# Altium schematic sheet BBB_Connections.SchDoc
size Tabloid
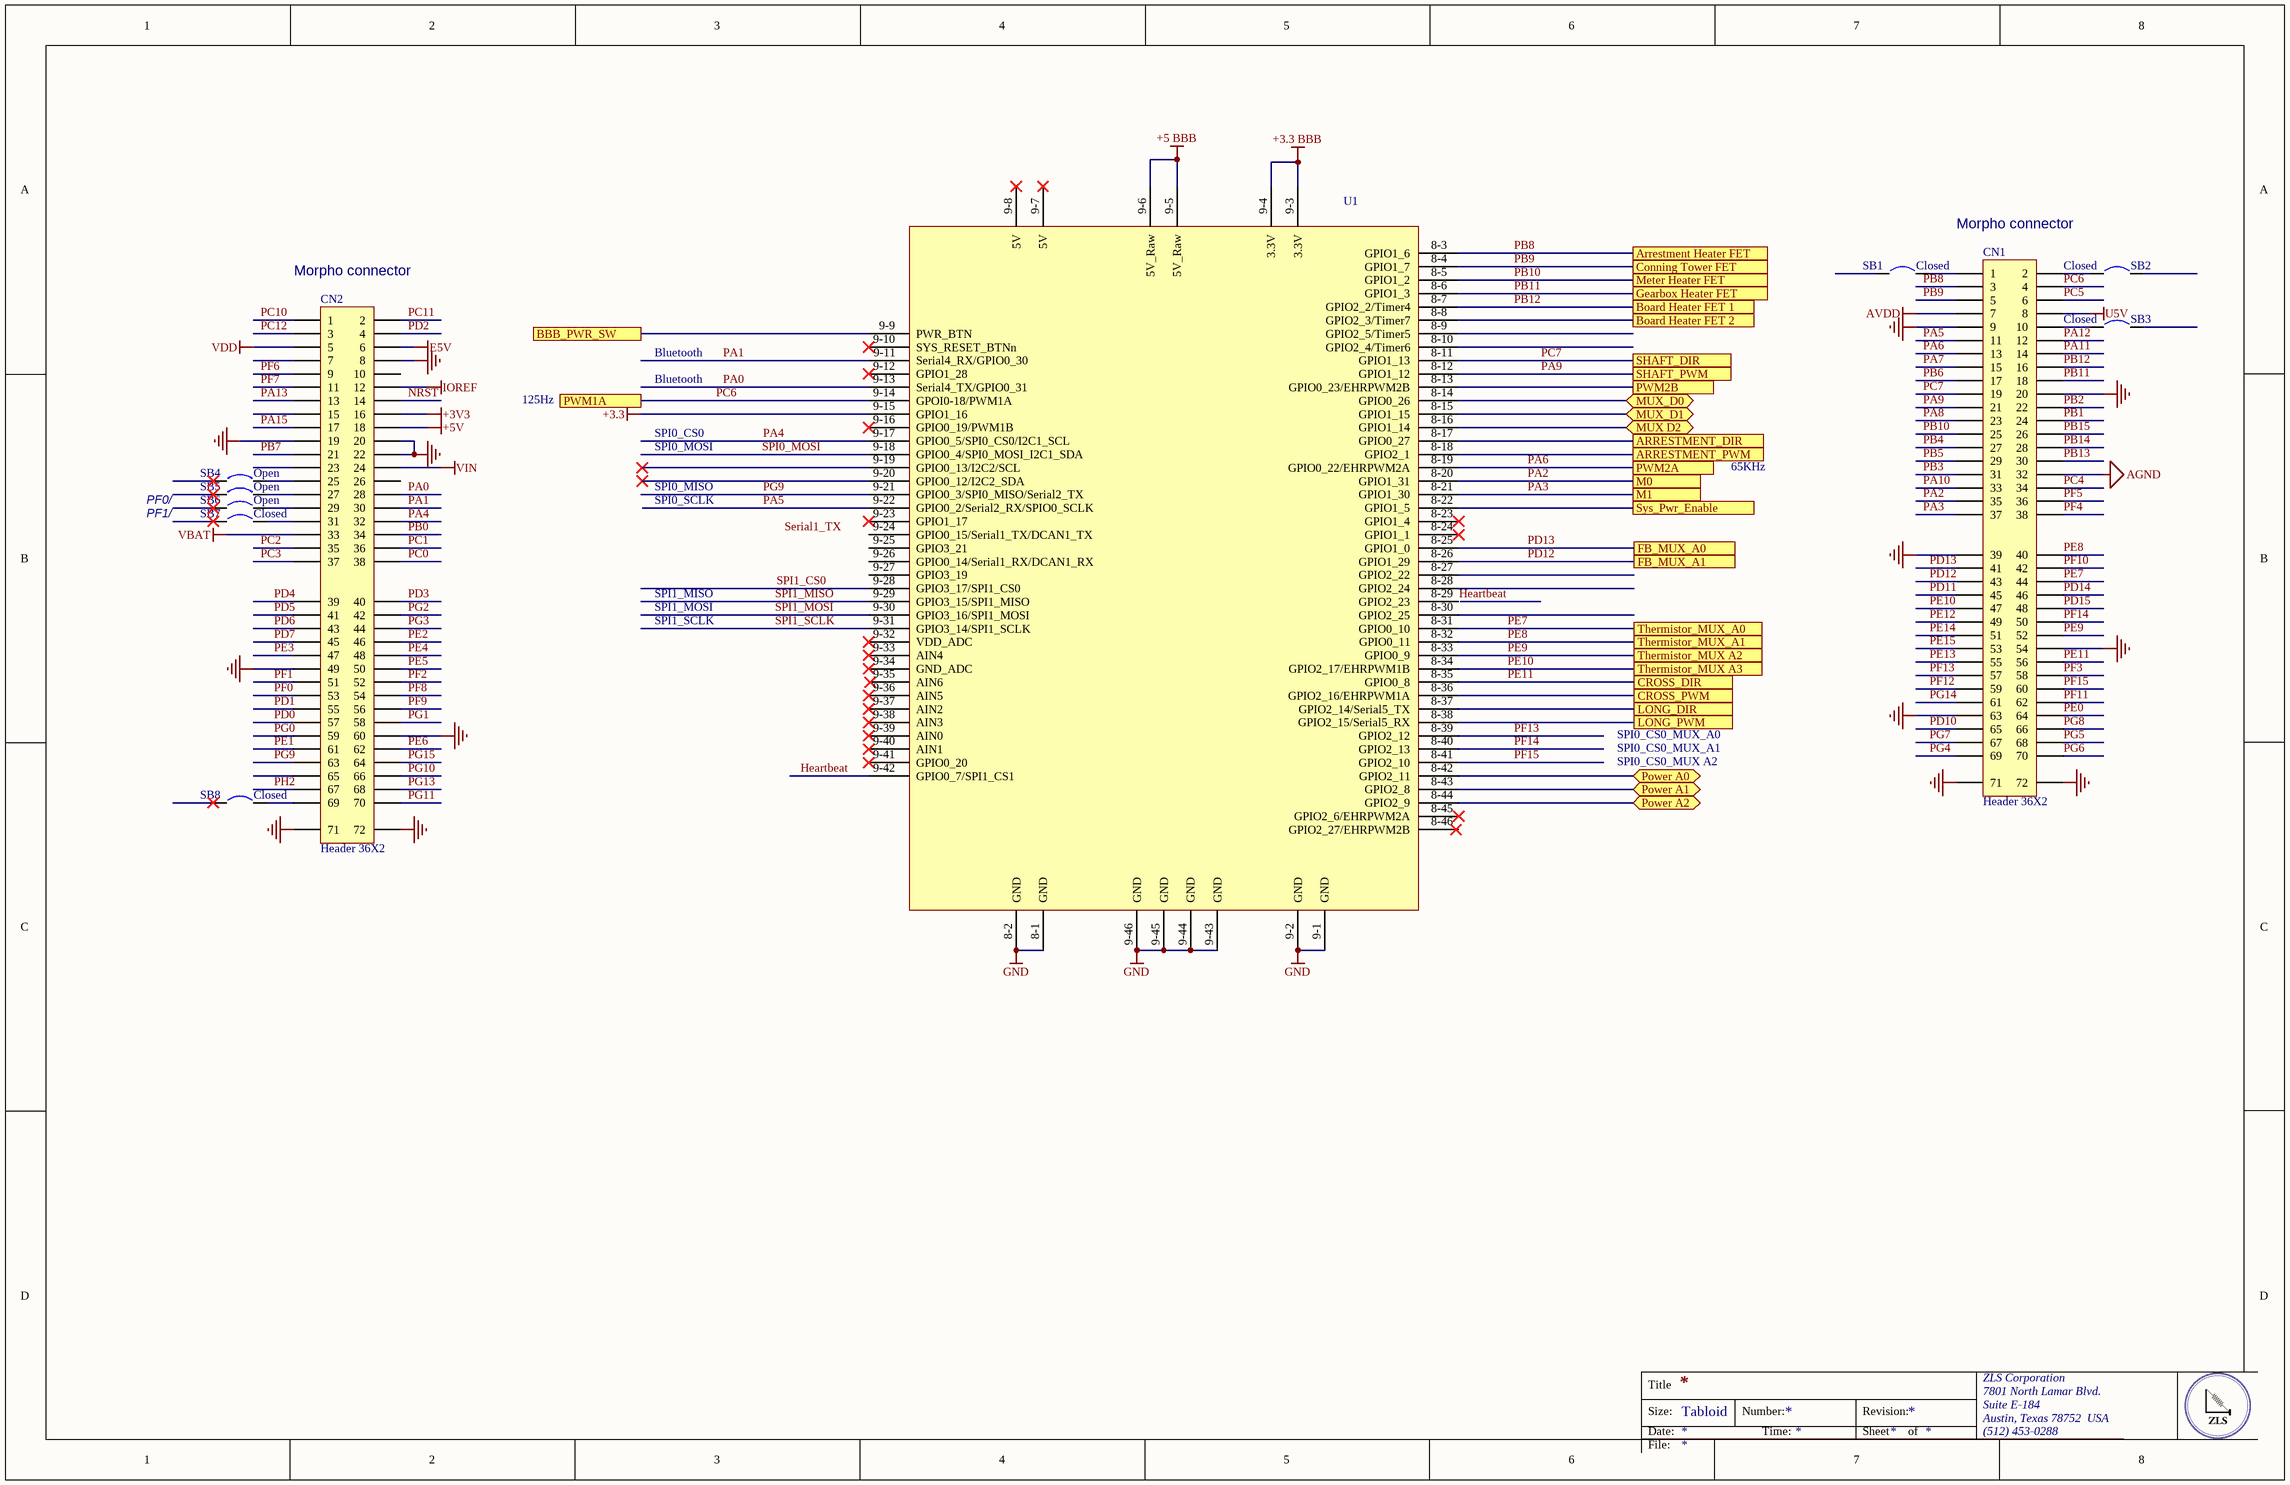
[diagram p0: BBB_Connections.SchDoc]

## Parts
CN1  Header 36X2  [HDR_2x36_2R54_V_M]
CN2  Header 36X2  [HDR_2x36_2R54_V_M]
SB1  Closed  [SB_0603]
SB2  Closed  [SB_0603]
SB3  Closed  [SB_0603]
SB4  Open  [SB_0603]
SB5  Open  [SB_0603]
SB6  Open  [SB_0603]
SB7  Closed  [SB_0603]
SB8  Closed  [SB_0603]
U1  BBB Header x 2  [Beaglebone Black Thru]  (value not drawn)

## Ports
Arrestment Heater FET, ARRESTMENT_DIR, ARRESTMENT_PWM, BBB_PWR_SW, Board Heater FET 1, Board Heater FET 2, Conning Tower FET, CROSS_DIR, CROSS_PWM, FB_MUX_A0, FB_MUX_A1, Gearbox Heater FET, LONG_DIR, LONG_PWM, M0, M1, Meter Heater FET, MUX D2, MUX_D0, MUX_D1, Power A0, Power A1, Power A2, PWM1A, PWM2A, PWM2B, SHAFT_DIR, SHAFT_PWM, Sys_Pwr_Enable, Thermistor_MUX A2, Thermistor_MUX A3, Thermistor_MUX_A0, Thermistor_MUX_A1

## Nets
+3.3: U1.9-15(GPIO1_16)
+3.3 BBB: U1.9-3(3.3V) U1.9-4(3.3V)
+3V3: CN2.16
+5 BBB: U1.9-5(5V_Raw) U1.9-6(5V_Raw)
+5V: CN2.18
AGND: CN1.32
AVDD: CN1.7
E5V: CN2.6
GND: CN1.9 CN1.20 CN1.39 CN1.54 CN1.63 CN1.71 CN1.72 CN2.8 CN2.19 CN2.20 CN2.22 CN2.49 CN2.60 CN2.71 CN2.72 U1.8-1(GND) U1.8-2(GND) U1.9-1(GND) U1.9-2(GND) U1.9-43(GND) U1.9-44(GND) U1.9-45(GND) U1.9-46(GND)
IOREF: CN2.12
U5V: CN1.8
VBAT: CN2.33
VDD: CN2.5
VIN: CN2.24
ARRESTMENT_DIR: U1.8-17(GPIO0_27) ; port ARRESTMENT_DIR
ARRESTMENT_PWM: U1.8-18(GPIO2_1) ; port ARRESTMENT_PWM
BBB_PWR_SW: U1.9-9(PWR_BTN) ; port BBB_PWR_SW
Board Heater FET 2: U1.8-8(GPIO2_3/Timer7) ; port Board Heater FET 2
CROSS_PWM: U1.8-36(GPIO2_16/EHRPWM1A) ; port CROSS_PWM
Heartbeat: U1.8-29(GPIO2_23) U1.9-42(GPIO0_7/SPI1_CS1)
LONG_DIR: U1.8-37(GPIO2_14/Serial5_TX) ; port LONG_DIR
LONG_PWM: U1.8-38(GPIO2_15/Serial5_RX) ; port LONG_PWM
MUX D2: U1.8-16(GPIO1_14) ; port MUX D2
MUX_D0: U1.8-14(GPIO0_26) ; port MUX_D0
MUX_D1: U1.8-15(GPIO1_15) ; port MUX_D1
NRST: CN2.14
PA0: CN2.28 U1.9-13(Serial4_TX/GPIO0_31)
PA1: CN2.30 U1.9-11(Serial4_RX/GPIO0_30)
PA2: CN1.35 U1.8-20(GPIO1_31) ; port M0
PA3: CN1.37 U1.8-21(GPIO1_30) ; port M1
PA4: CN2.32 U1.9-17(GPIO0_5/SPI0_CS0/I2C1_SCL)
PA5: CN1.11 U1.9-22(GPIO0_2/Serial2_RX/SPIO0_SCLK)
PA6: CN1.13 U1.8-19(GPIO0_22/EHRPWM2A) ; port PWM2A
PA7: CN1.15
PA8: CN1.23
PA9: CN1.21 U1.8-12(GPIO1_12) ; port SHAFT_PWM
PA10: CN1.33
PA11: CN1.14
PA12: CN1.12
PA13: CN2.13
PA15: CN2.17
PB0: CN2.34
PB1: CN1.24
PB2: CN1.22
PB3: CN1.31
PB4: CN1.27
PB5: CN1.29
PB6: CN1.17
PB7: CN2.21
PB8: CN1.3 U1.8-3(GPIO1_6) ; port Arrestment Heater FET
PB9: CN1.5 U1.8-4(GPIO1_7) ; port Conning Tower FET
PB10: CN1.25 U1.8-5(GPIO1_2) ; port Meter Heater FET
PB11: CN1.18 U1.8-6(GPIO1_3) ; port Gearbox Heater FET
PB12: CN1.16 U1.8-7(GPIO2_2/Timer4) ; port Board Heater FET 1
PB13: CN1.30
PB14: CN1.28
PB15: CN1.26
PC0: CN2.38
PC1: CN2.36
PC2: CN2.35
PC3: CN2.37
PC4: CN1.34
PC5: CN1.6
PC6: CN1.4 U1.9-14(GPOI0-18/PWM1A) ; port PWM1A
PC7: CN1.19 U1.8-11(GPIO1_13) ; port SHAFT_DIR
PC10: CN2.1
PC11: CN2.2
PC12: CN2.3
PD0: CN2.57
PD1: CN2.55
PD2: CN2.4
PD3: CN2.40
PD4: CN2.39
PD5: CN2.41
PD6: CN2.43
PD7: CN2.45
PD10: CN1.65
PD11: CN1.45
PD12: CN1.43 U1.8-26(GPIO1_29) ; port FB_MUX_A1
PD13: CN1.41 U1.8-25(GPIO1_0) ; port FB_MUX_A0
PD14: CN1.46
PD15: CN1.48
PE0: CN1.64
PE1: CN2.61
PE2: CN2.46
PE3: CN2.47
PE4: CN2.48
PE5: CN2.50
PE6: CN2.62
PE7: CN1.44 U1.8-31(GPIO0_10) ; port Thermistor_MUX_A0
PE8: CN1.40 U1.8-32(GPIO0_11) ; port Thermistor_MUX_A1
PE9: CN1.52 U1.8-33(GPIO0_9) ; port Thermistor_MUX A2
PE10: CN1.47 U1.8-34(GPIO2_17/EHRPWM1B) ; port Thermistor_MUX A3
PE11: CN1.56 U1.8-35(GPIO0_8) ; port CROSS_DIR
PE12: CN1.49
PE13: CN1.55
PE14: CN1.51
PE15: CN1.53
PF0: CN2.53
PF1: CN2.51
PF2: CN2.52
PF3: CN1.58
PF4: CN1.38
PF5: CN1.36
PF6: CN2.9
PF7: CN2.11
PF8: CN2.54
PF9: CN2.56
PF10: CN1.42
PF11: CN1.62
PF12: CN1.59
PF13: CN1.57 U1.8-39(GPIO2_12)
PF14: CN1.50 U1.8-40(GPIO2_13)
PF15: CN1.60 U1.8-41(GPIO2_10)
PG0: CN2.59
PG1: CN2.58
PG2: CN2.42
PG3: CN2.44
PG4: CN1.69
PG5: CN1.68
PG6: CN1.70
PG7: CN1.67
PG8: CN1.66
PG9: CN2.63 U1.9-21(GPIO0_3/SPI0_MISO/Serial2_TX)
PG10: CN2.66
PG11: CN2.70
PG13: CN2.68
PG14: CN1.61
PG15: CN2.64
PH2: CN2.67
Power A0: U1.8-42(GPIO2_11) ; port Power A0
Power A1: U1.8-43(GPIO2_8) ; port Power A1
Power A2: U1.8-44(GPIO2_9) ; port Power A2
PWM2B: U1.8-13(GPIO0_23/EHRPWM2B) ; port PWM2B
SPI0_MOSI: U1.9-18(GPIO0_4/SPI0_MOSI_I2C1_SDA)
SPI1_CS0: U1.9-28(GPIO3_17/SPI1_CS0)
SPI1_MISO: U1.9-29(GPIO3_15/SPI1_MISO)
SPI1_MOSI: U1.9-30(GPIO3_16/SPI1_MOSI)
SPI1_SCLK: U1.9-31(GPIO3_14/SPI1_SCLK)
Sys_Pwr_Enable: U1.8-22(GPIO1_5) ; port Sys_Pwr_Enable
NetCN1_1: CN1.1 SB1.2
NetCN1_2: CN1.2 SB2.2
NetCN1_10: CN1.10 SB3.1
NetCN2_25: CN2.25 SB4.2
NetCN2_27: CN2.27 SB5.2
NetCN2_29: CN2.29 SB6.2
NetCN2_31: CN2.31 SB7.2
NetCN2_69: CN2.69 SB8.2

Not connected (* = marked no-connect by the designer): CN2 7 10 15 23 26 65; SB1 1; SB2 1; SB3 2; SB4 1*; SB5 1*; SB6 1*; SB7 1*; SB8 1*; U1 8-9(GPIO2_5/Timer5) 8-10(GPIO2_4/Timer6) 8-23(GPIO1_4)* 8-24(GPIO1_1)* 8-27(GPIO2_22) 8-28(GPIO2_24) 8-30(GPIO2_25) 8-45(GPIO2_6/EHRPWM2A)* 8-46(GPIO2_27/EHRPWM2B) 9-7(5V)* 9-8(5V)* 9-10(SYS_RESET_BTNn)* 9-12(GPIO1_28)* 9-16(GPIO0_19/PWM1B)* 9-19(GPIO0_13/I2C2/SCL)* 9-20(GPIO0_12/I2C2_SDA)* 9-23(GPIO1_17)* 9-24(GPIO0_15/Serial1_TX/DCAN1_TX) 9-25(GPIO3_21) 9-26(GPIO0_14/Serial1_RX/DCAN1_RX) 9-27(GPIO3_19) 9-32(VDD_ADC)* 9-33(AIN4)* 9-34(GND_ADC)* 9-35(AIN6) 9-36(AIN5)* 9-37(AIN2)* 9-38(AIN3)* 9-39(AIN0)* 9-40(AIN1)* 9-41(GPIO0_20)*

## Notes on the sheet
- Morpho connector
- (near CN2) Morpho connector
- Bluetooth
- 125Hz
- SPI0_CS0
- SPI0_MISO
- SPI0_MOSI
- 65KHz
- PF0/
- PF1/
- SPI0_SCLK
- SPI1_MISO
- SPI1_SCLK
- SPI1_MOSI
- (near CN2) /PH1
- (near CN2) /PH0
- SPI0_CS0_MUX_A0
- SPI0_CS0_MUX_A1
- SPI0_CS0_MUX A2
- Labels drawn without touching a wire or pin: Serial1_TX
- Title
- Size:
- Date:
- Tabloid
- Number:
- Time:
- Revision:
- Sheet
- of
- ZLS Corporation
- 7801 North Lamar Blvd.
- Suite E-184
- Austin, Texas 78752  USA
- (512) 453-0288
- File:

## Library data of the parts
CN1 CN2 = Header 36X2: Header, 36-Pin, Dual row; Revision: 17-Jul-2002: Re-released for DXP Platform.; Publisher: Altium Limited
SB1-SB3 SB7 SB8 = Circuit Breaker_close: Circuit Breaker; Published: 24-Mar-1999; Revision: July-2002: Re-released for DXP Platform.; Publisher: Altium Limited
SB4-SB6 = Circuit Breaker: Published: 24-Mar-1999; Revision: July-2002: Re-released for DXP Platform.; Publisher: Altium Limited
U1 = Beaglebone_Black: Beaglebone Black Header; Manufacturer: Samtec Inc.; Manufacturer Part Number: SSW-123-03-G-D; Connector Type: Receptacle; Style: Board to Board or Cable; Number of Positions: 46; Number of Positions Loaded: All; Pitch - Mating: 0.100" (2.54mm); Contact Length - Post: 0.394" (10.00mm); Material Flammability Rating: UL94 V-0; Current Rating: 5.7A per Contact; Supplier 1: Digi-Key; Supplier Part Number 1: SSW-123-03-G-D-ND; RoHS: RoHS Compliant; Category: Connectors, Interconnects; Stock 1: 0; Pricing 1: 1=6.51 (USD); Packaging: Bulk; Part Status: Active; Contact Type: Forked; Row Spacing - Mating: 0.100" (2.54mm); Mounting Type: Through Hole; Termination: Solder; Fastening Type: Push-Pull; Contact Finish - Mating: Gold; Contact Finish Thickness - Mating: 20.0µin (0.51µm); Insulation Color: Black; Insulation Height: 0.335" (8.51mm); Operating Temperature: -55°C ~ 125°C; Contact Finish - Post: Gold; Mated Stacking Heights: -; Ingress Protection: -; Features: -; Voltage Rating: -; Applications: -; Insulation Material: Liquid Crystal Polymer (LCP); Contact Shape: Square; Contact Material: Phosphor Bronze; Contact Finish Thickness - Post: 3.00µin (0.076µm)